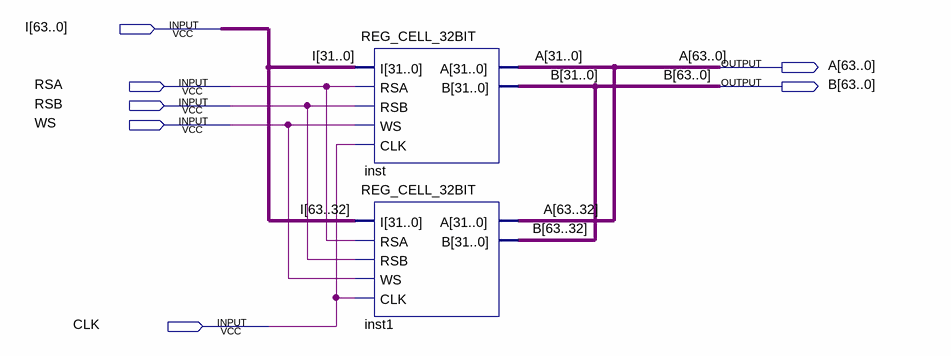
[diagram p0: schematic sheet]
// Quartus schematic REG_CELL_64BIT.bdf as structural Verilog: 2 symbols, 7 pins
module REG_CELL_64BIT (
  input  [63:0] I,
  input  RSA,
  input  RSB,
  input  WS,
  input  CLK,
  output [63:0] A,
  output [63:0] B
);

  REG_CELL_32BIT inst (.I(I[31:0]), .RSA(RSA), .RSB(RSB), .WS(WS), .CLK(CLK), .A(A[31:0]), .B(B[31:0]));
  REG_CELL_32BIT inst1 (.I(I[63:32]), .RSA(RSA), .RSB(RSB), .WS(WS), .CLK(CLK), .A(A[63:32]), .B(B[63:32]));
endmodule
